# Altium project 3562.PrjPcb (part 5 of 5)

## Sheet P19_HDMI OUT.SchDoc
size 594 x 420 mm
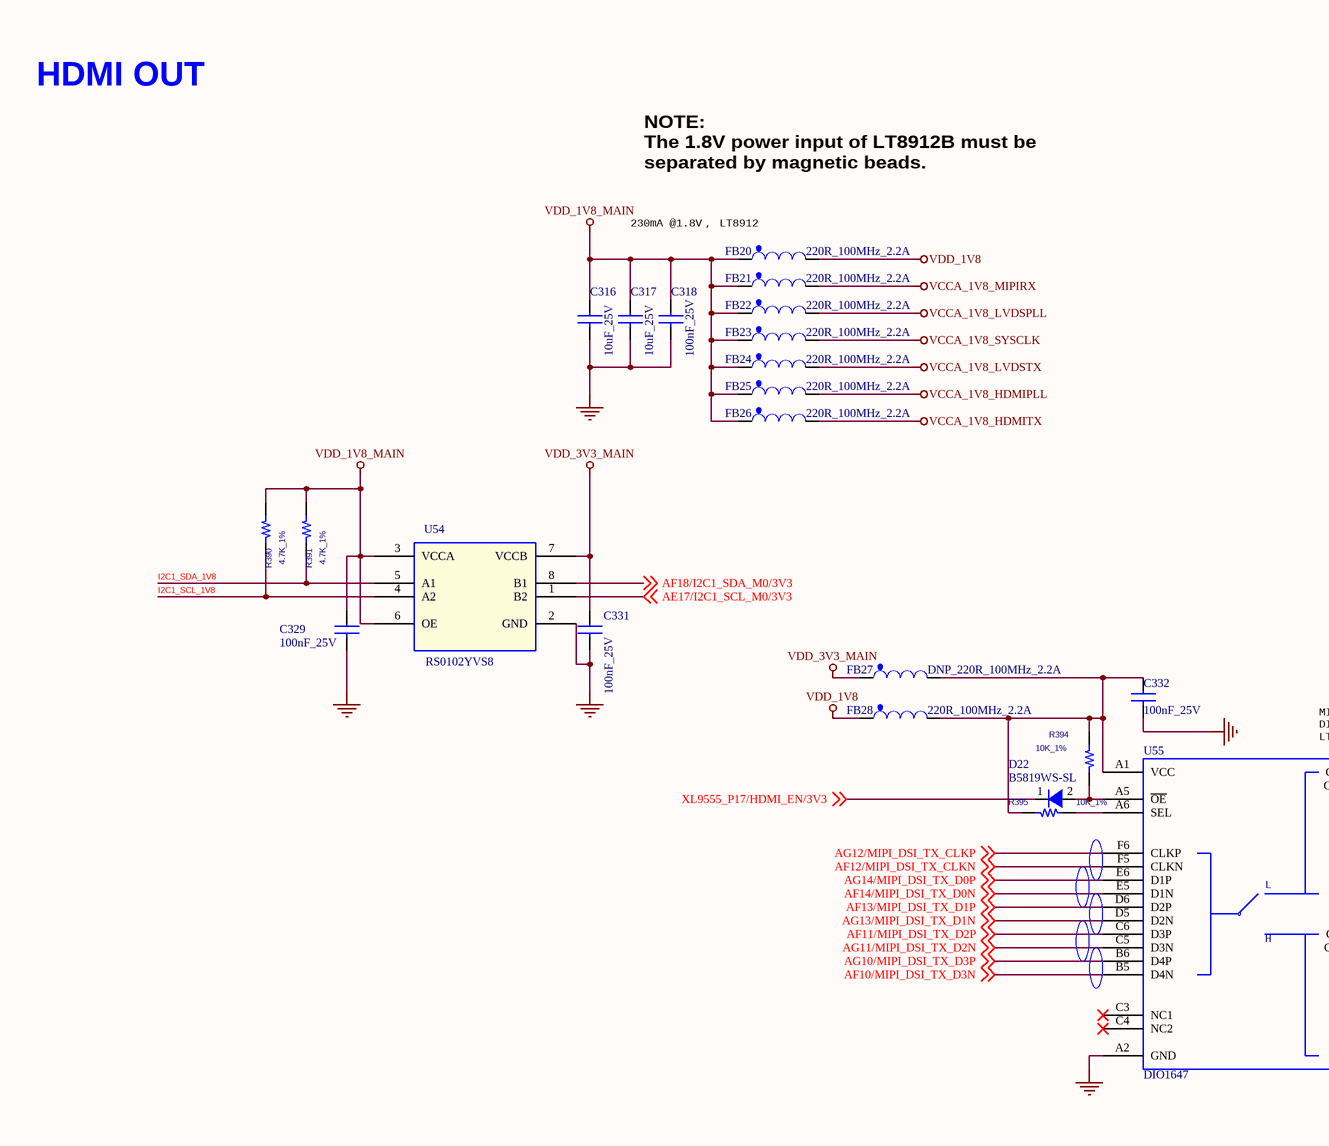
[diagram p36: P19_HDMI OUT.SchDoc, top left]
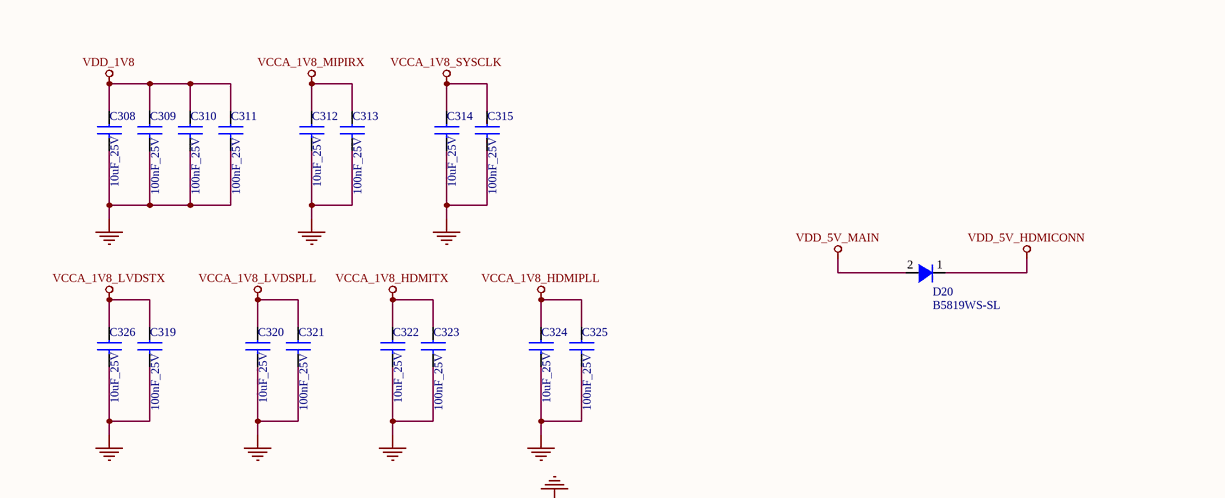
[diagram p37: P19_HDMI OUT.SchDoc, top right]
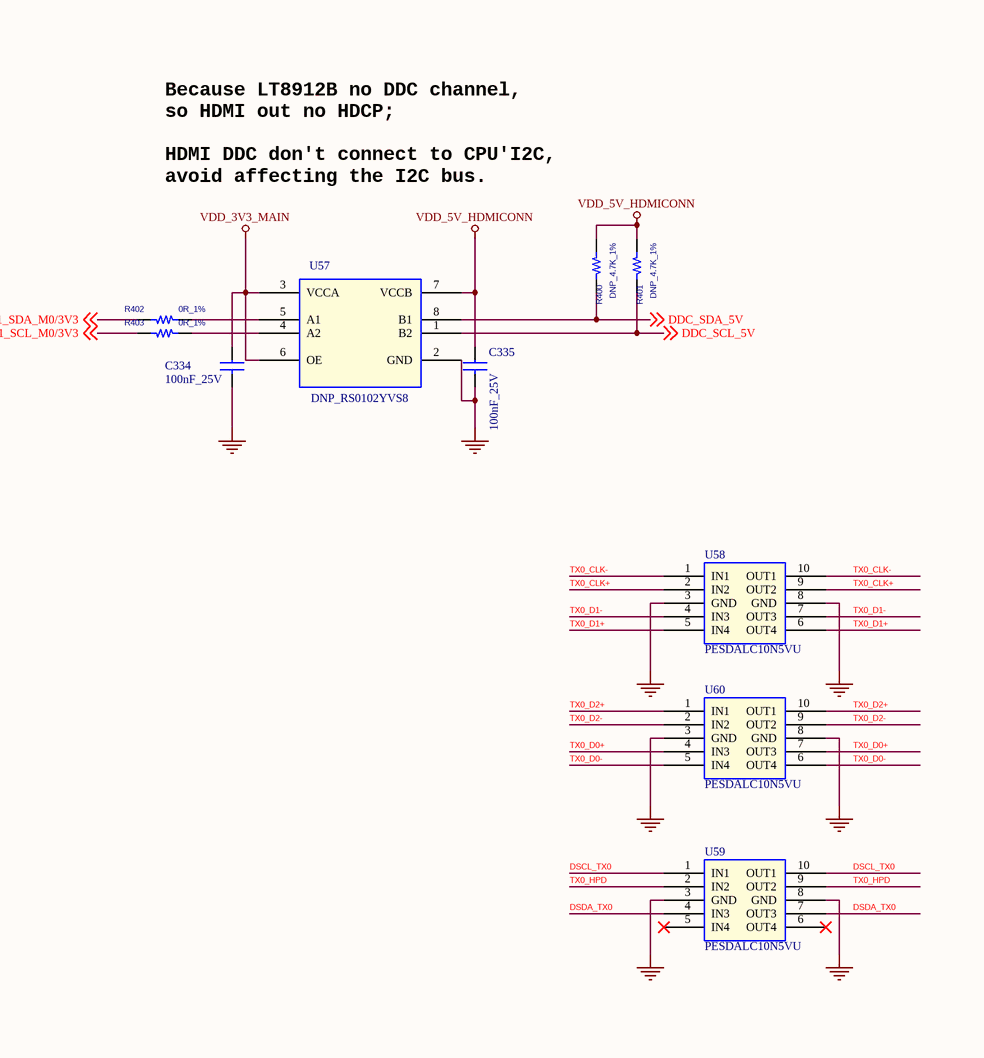
[diagram p38: P19_HDMI OUT.SchDoc, bottom left]
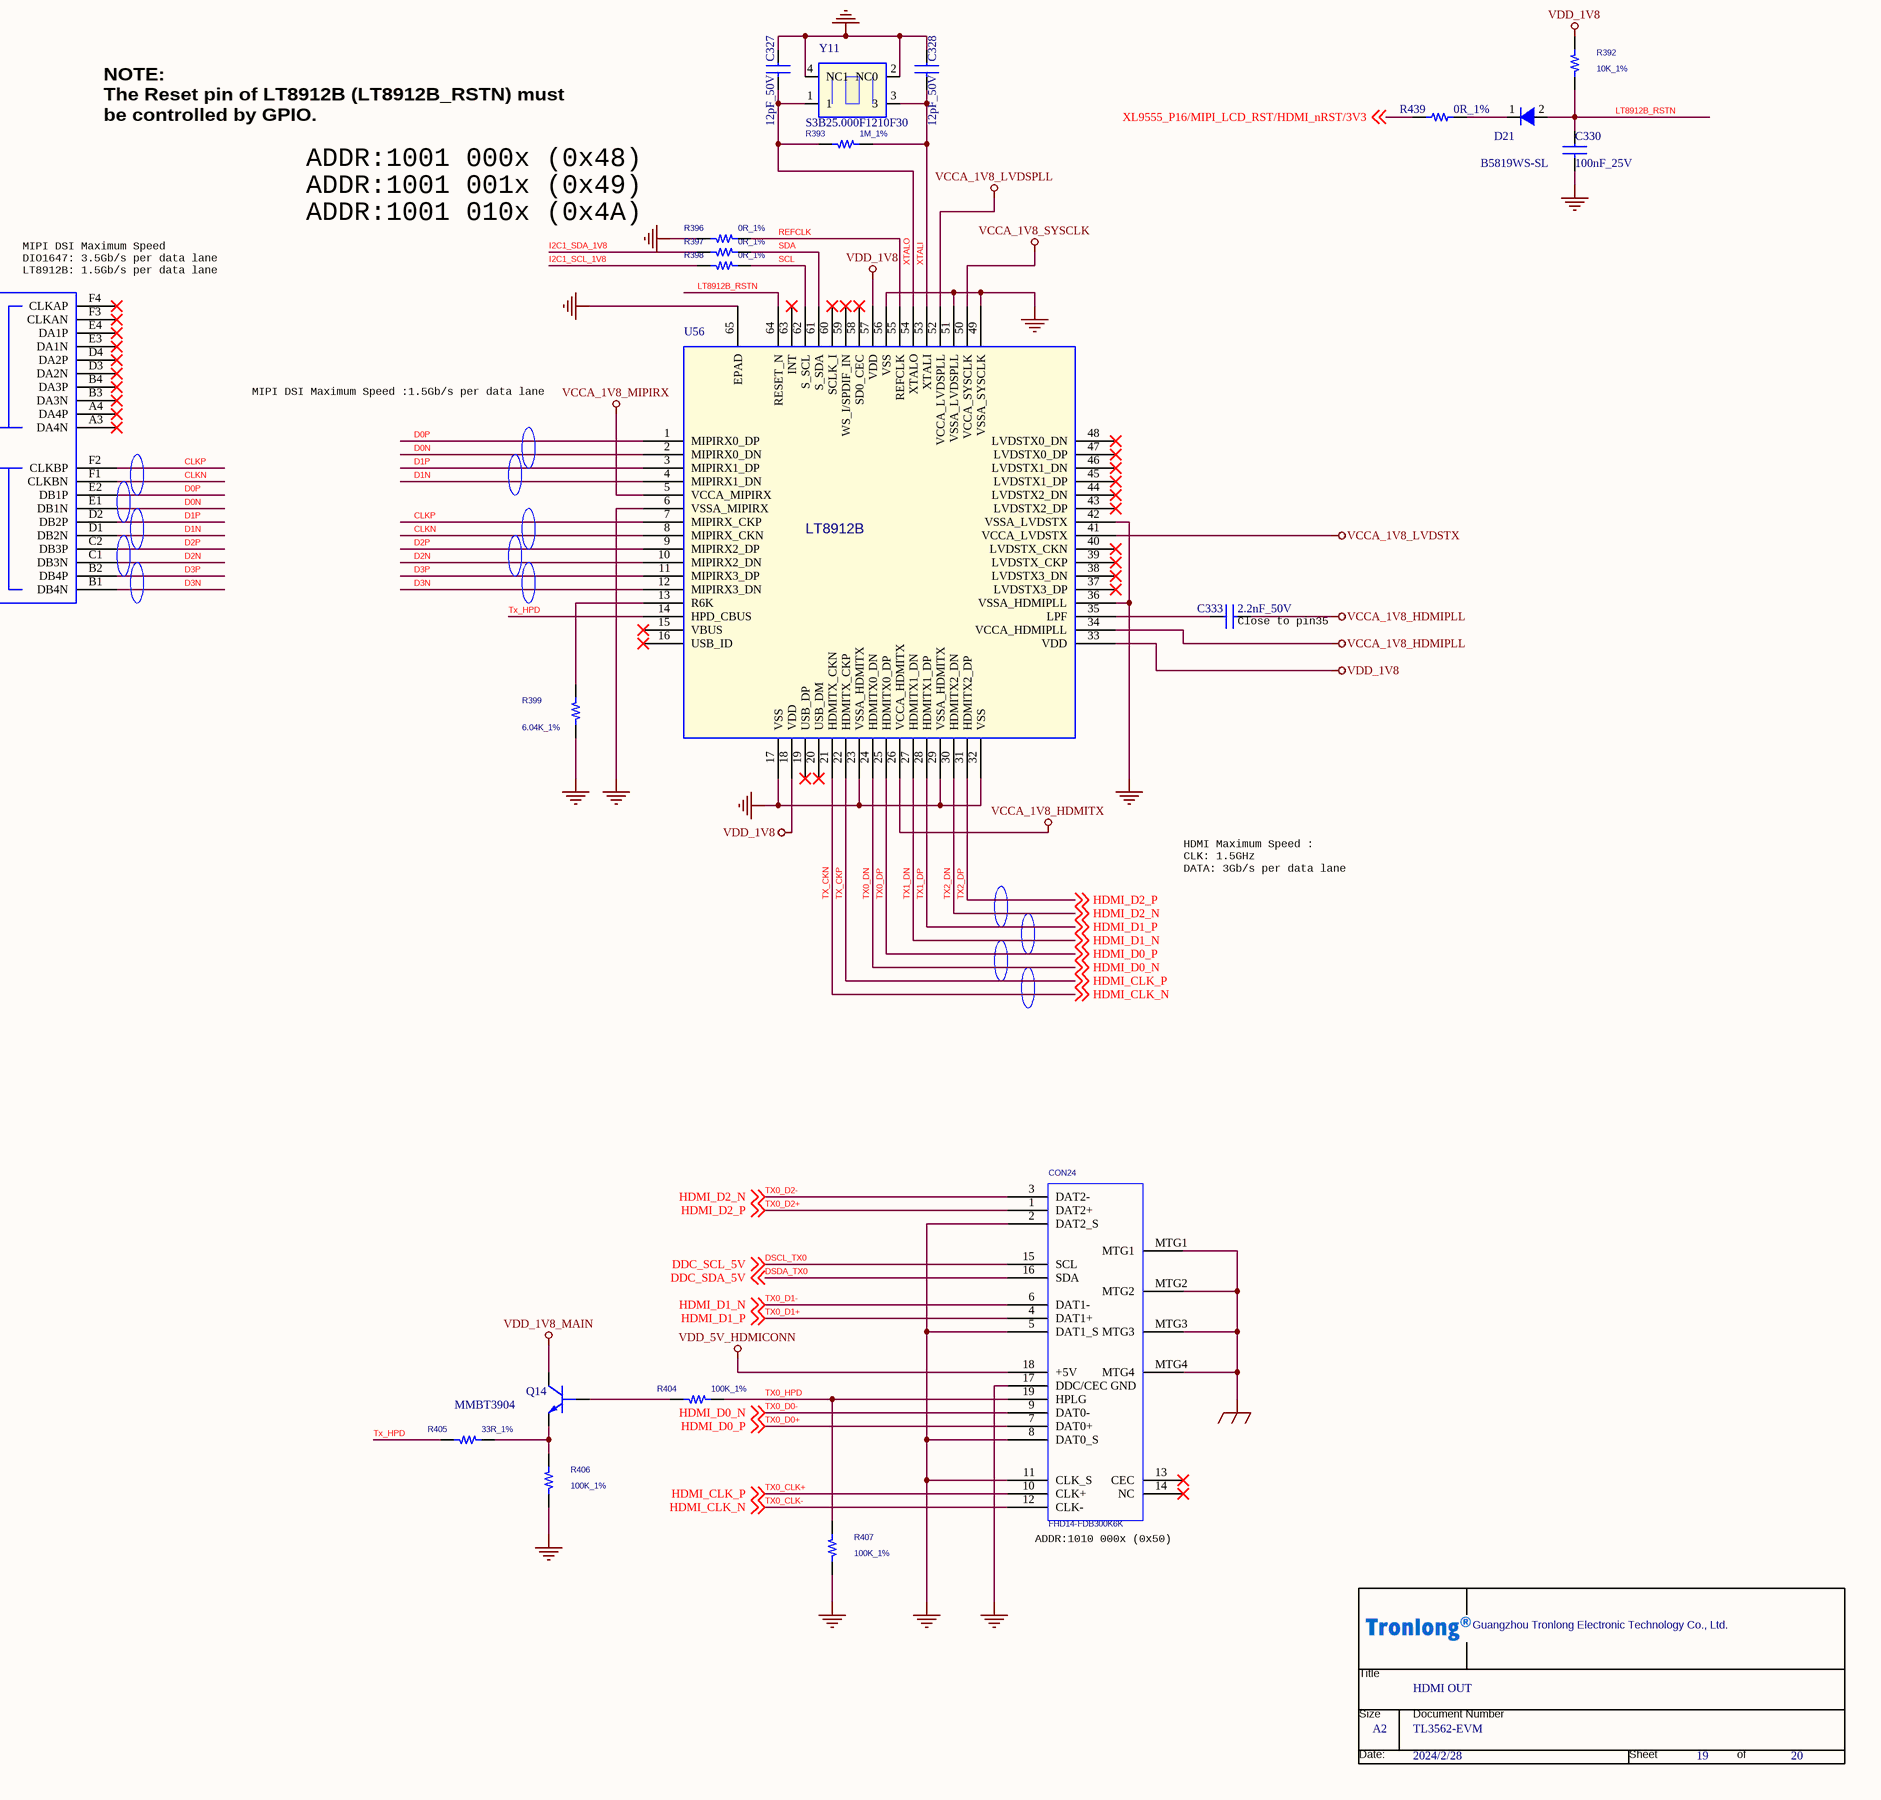
[diagram p39: P19_HDMI OUT.SchDoc, bottom right]

### Parts
(Parts that share a designator on the sheet are numbered #1, #2 ... from top to bottom, then left to right.)
*#19  Page Count: 20  Page Number: 19  Page Size: A2  OrgName: Guangzhou Tronlong Electronic Technology Co., Ltd.  Title: HDMI OUT  Doc: TL3562-EVM  Page Modify Date: 2024/2/28  (hidden comment: Tronlong_TITTLE_20211115)  (graphical)
C308  10uF_25V  [C0603]
C309  100nF_25V  [C0402]
C310  100nF_25V  [C0402]
C311  100nF_25V  [C0402]
C312  10uF_25V  [C0603]
C313  100nF_25V  [C0402]
C314  10uF_25V  [C0603]
C315  100nF_25V  [C0402]
C316  10uF_25V  [C0603]
C317  10uF_25V  [C0603]
C318  100nF_25V  [C0402]
C319  100nF_25V  [C0402]
C320  10uF_25V  [C0603]
C321  100nF_25V  [C0402]
C322  10uF_25V  [C0603]
C323  100nF_25V  [C0402]
C324  10uF_25V  [C0603]
C325  100nF_25V  [C0402]
C326  10uF_25V  [C0603]
C327  12pF_50V  [C0402]
C328  12pF_50V  [C0402]
C329  100nF_25V  [C0402]
C330  100nF_25V  [C0402]
C331  100nF_25V  [C0402]
C332  100nF_25V  [C0402]
C333  2.2nF_50V  [C0603]
C334  100nF_25V  [C0402]
C335  100nF_25V  [C0402]
CON24  FHD14-FDB300K6K  [DIP_HDMI-A]
D20  B5819WS-SL  [SOD-323]
D21  B5819WS-SL  [SOD-323]
D22  B5819WS-SL  [SOD-323]
FB20  220R_100MHz_2.2A  [L0603]
FB21  220R_100MHz_2.2A  [L0603]
FB22  220R_100MHz_2.2A  [L0603]
FB23  220R_100MHz_2.2A  [L0603]
FB24  220R_100MHz_2.2A  [L0603]
FB25  220R_100MHz_2.2A  [L0603]
FB26  220R_100MHz_2.2A  [L0603]
FB27  DNP_220R_100MHz_2.2A  [L0603]
FB28  220R_100MHz_2.2A  [L0603]
Q14  MMBT3904  [SOT23-3_DBZ3]
R390  4.7K_1%  [R0402]
R391  4.7K_1%  [R0402]
R392  10K_1%  [R0402]
R393  1M_1%  [R0603]
R394  10K_1%  [R0402]
R395  10K_1%  [R0402]
R396  0R_1%  [R0402]
R397  0R_1%  [R0402]
R398  0R_1%  [R0402]
R399  6.04K_1%  [R0402]
R400  DNP_4.7K_1%  [R0402]
R401  DNP_4.7K_1%  [R0402]
R402  0R_1%  [R0402]
R403  0R_1%  [R0402]
R404  100K_1%  [R0402]
R405  33R_1%  [R0402]
R406  100K_1%  [R0402]
R407  100K_1%  [R0402]
R439  0R_1%  [R0402]
U54  RS0102YVS8  [SOP8-20-91]
U55  DIO1647  [WLCSP-36-0d4mm]
U56  LT8912B  [QFN64_LT8912B]
U57  DNP_RS0102YVS8  [SOP8-20-91]
U58  PESDALC10N5VU  [DFN-10-2510]
U59  PESDALC10N5VU  [DFN-10-2510]
U60  PESDALC10N5VU  [DFN-10-2510]
Y11  S3B25.000F1210F30  [SMD_3225]

### Nets
EGND: CON24.MTG1 CON24.MTG2 CON24.MTG3 CON24.MTG4
GND: C308.2 C309.2 C310.2 C311.2 C312.2 C313.2 C314.2 C315.2 C316.2 C317.2 C318.2 C319.2 C320.2 C321.2 C322.2 C323.2 C324.2 C325.2 C326.2 C327.1 C328.1 C329.2 C330.2 C331.2 C332.2 C334.2 C335.2 CON24.2(DAT2_S) CON24.5(DAT1_S) CON24.8(DAT0_S) CON24.11(CLK_S) CON24.17(DDC/CEC_GND) R396.1 R399.1 R406.1 R407.1 U54.2(GND) U55.A2(GND) U56.6(VSSA_MIPIRX) U56.17(VSS) U56.23(VSSA_HDMITX) U56.29(VSSA_HDMITX) U56.32(VSS) U56.36(VSSA_HDMIPLL) U56.42(VSSA_LVDSTX) U56.49(VSSA_SYSCLK) U56.51(VSSA_LVDSPLL) U56.56(VSS) U56.65(EPAD) U57.2(GND) U58.3(GND) U58.8(GND) U59.3(GND) U59.8(GND) U60.3(GND) U60.8(GND) Y11.2(NC0) Y11.4(NC1)
VCCA_1V8_HDMIPLL: C324.1 C325.1 C333.2 FB25.2 U56.34(VCCA_HDMIPLL)
VCCA_1V8_HDMITX: C322.1 C323.1 FB26.2 U56.26(VCCA_HDMITX)
VCCA_1V8_LVDSPLL: C320.1 C321.1 FB22.2 U56.52(VCCA_LVDSPLL)
VCCA_1V8_LVDSTX: C319.1 C326.1 FB24.2 U56.41(VCCA_LVDSTX)
VCCA_1V8_MIPIRX: C312.1 C313.1 FB21.2 U56.5(VCCA_MIPIRX)
VCCA_1V8_SYSCLK: C314.1 C315.1 FB23.2 U56.50(VCCA_SYSCLK)
VDD_1V8: C308.1 C309.1 C310.1 C311.1 FB20.2 FB28.1 R392.2 U56.18(VDD) U56.33(VDD) U56.57(VDD)
VDD_1V8_MAIN: C316.1 C317.1 C318.1 C329.1 FB20.1 FB21.1 FB22.1 FB23.1 FB24.1 FB25.1 FB26.1 Q14.3(C) R390.2 R391.2 U54.3(VCCA) U54.6(OE)
VDD_3V3_MAIN: C331.1 C334.1 FB27.1 U54.7(VCCB) U57.3(VCCA) U57.6(OE)
VDD_5V_HDMICONN: C335.1 CON24.18(+5V) D20.1(Anode) R400.2 R401.2 U57.7(VCCB)
VDD_5V_MAIN: D20.2(Cathode)
AE17/I2C1_SCL_M0/3V3: R403.2 U54.1(B2) ; off-sheet AE17/I2C1_SCL_M0/3V3  [project net I2C1_SCL]
AF10/MIPI_DSI_TX_D3N: U55.B5(D4N) ; off-sheet AF10/MIPI_DSI_TX_D3N
AF11/MIPI_DSI_TX_D2P: U55.C6(D3P) ; off-sheet AF11/MIPI_DSI_TX_D2P
AF12/MIPI_DSI_TX_CLKN: U55.F5(CLKN) ; off-sheet AF12/MIPI_DSI_TX_CLKN
AF13/MIPI_DSI_TX_D1P: U55.D6(D2P) ; off-sheet AF13/MIPI_DSI_TX_D1P
AF14/MIPI_DSI_TX_D0N: U55.E5(D1N) ; off-sheet AF14/MIPI_DSI_TX_D0N
AF18/I2C1_SDA_M0/3V3: R402.2 U54.8(B1) ; off-sheet AF18/I2C1_SDA_M0/3V3  [project net I2C1_SDA]
AG10/MIPI_DSI_TX_D3P: U55.B6(D4P) ; off-sheet AG10/MIPI_DSI_TX_D3P
AG11/MIPI_DSI_TX_D2N: U55.C5(D3N) ; off-sheet AG11/MIPI_DSI_TX_D2N
AG12/MIPI_DSI_TX_CLKP: U55.F6(CLKP) ; off-sheet AG12/MIPI_DSI_TX_CLKP
AG13/MIPI_DSI_TX_D1N: U55.D5(D2N) ; off-sheet AG13/MIPI_DSI_TX_D1N
AG14/MIPI_DSI_TX_D0P: U55.E6(D1P) ; off-sheet AG14/MIPI_DSI_TX_D0P
CLKN: U55.F1(CLKBN) U56.8(MIPIRX_CKN)
CLKP: U55.F2(CLKBP) U56.7(MIPIRX_CKP)
D0N: U55.E1(DB1N) U56.2(MIPIRX0_DN)
D0P: U55.E2(DB1P) U56.1(MIPIRX0_DP)
D1N: U55.D1(DB2N) U56.4(MIPIRX1_DN)
D1P: U55.D2(DB2P) U56.3(MIPIRX1_DP)
D2N: U55.C1(DB3N) U56.10(MIPIRX2_DN)
D2P: U55.C2(DB3P) U56.9(MIPIRX2_DP)
D3N: U55.B1(DB4N) U56.12(MIPIRX3_DN)
D3P: U55.B2(DB4P) U56.11(MIPIRX3_DP)
DSCL_TX0: CON24.15(SCL) R401.1 U57.1(B2) U59.1(IN1) U59.10(OUT1) ; off-sheet DDC_SCL_5V  [also labelled DDC_SCL_5V]
DSDA_TX0: CON24.16(SDA) R400.1 U57.8(B1) U59.4(IN3) U59.7(OUT3) ; off-sheet DDC_SDA_5V  [also labelled DDC_SDA_5V]
I2C1_SCL_1V8: R390.1 R398.1 U54.4(A2)
I2C1_SDA_1V8: R391.1 R397.1 U54.5(A1)
LT8912B_RSTN: C330.1 D21.2(Cathode) R392.1 U56.64(RESET_N)
REFCLK: R396.2 U56.55(REFCLK)
SCL: R398.2 U56.62(S_SCL)
SDA: R397.2 U56.61(S_SDA)
TX0_CLK+: CON24.10(CLK+) U56.22(HDMITX_CKP) U58.2(IN2) U58.9(OUT2) ; off-sheet HDMI_CLK_P  [also labelled HDMI_CLK_P, TX_CKP]
TX0_CLK-: CON24.12(CLK-) U56.21(HDMITX_CKN) U58.1(IN1) U58.10(OUT1) ; off-sheet HDMI_CLK_N  [also labelled HDMI_CLK_N, TX_CKN]
TX0_D0+: CON24.7(DAT0+) U56.25(HDMITX0_DP) U60.4(IN3) U60.7(OUT3) ; off-sheet HDMI_D0_P  [also labelled HDMI_D0_P, TX0_DP]
TX0_D0-: CON24.9(DAT0-) U56.24(HDMITX0_DN) U60.5(IN4) U60.6(OUT4) ; off-sheet HDMI_D0_N  [also labelled HDMI_D0_N, TX0_DN]
TX0_D1+: CON24.4(DAT1+) U56.28(HDMITX1_DP) U58.5(IN4) U58.6(OUT4) ; off-sheet HDMI_D1_P  [also labelled HDMI_D1_P, TX1_DP]
TX0_D1-: CON24.6(DAT1-) U56.27(HDMITX1_DN) U58.4(IN3) U58.7(OUT3) ; off-sheet HDMI_D1_N  [also labelled HDMI_D1_N, TX1_DN]
TX0_D2+: CON24.1(DAT2+) U56.31(HDMITX2_DP) U60.1(IN1) U60.10(OUT1) ; off-sheet HDMI_D2_P  [also labelled HDMI_D2_P, TX2_DP]
TX0_D2-: CON24.3(DAT2-) U56.30(HDMITX2_DN) U60.2(IN2) U60.9(OUT2) ; off-sheet HDMI_D2_N  [also labelled HDMI_D2_N, TX2_DN]
TX0_HPD: CON24.19(HPLG) R404.1 R407.2 U59.2(IN2) U59.9(OUT2)
Tx_HPD: R405.2 U56.14(HPD_CBUS)
XL9555_P16/MIPI_LCD_RST/HDMI_nRST/3V3: R439.2 ; off-sheet XL9555_P16/MIPI_LCD_RST/HDMI_nRST/3V3
XL9555_P17/HDMI_EN/3V3: D22.1(Anode) ; off-sheet XL9555_P17/HDMI_EN/3V3
XTALI: C328.2 R393.1 U56.53(XTALI) Y11.3
XTALO: C327.2 R393.2 U56.54(XTALO) Y11.1
NetC332_1: C332.1 FB27.2 FB28.2 R394.1 R395.1 U55.A1(VCC)
NetC333_1: C333.1 U56.35(LPF)
NetD21_1: D21.1(Anode) R439.1
NetD22_2: D22.2(Cathode) R394.2 U55.A5(~{OE})
NetQ14_1: Q14.1(B) R404.2
NetQ14_2: Q14.2(E) R405.1 R406.2
NetR395_2: R395.2 U55.A6(SEL)
NetR399_2: R399.2 U56.13(R6K)
NetR402_1: R402.1 U57.5(A1)
NetR403_1: R403.1 U57.4(A2)

Not connected (* = marked no-connect by the designer): CON24 13(CEC)* 14(NC)*; U55 A3(DA4N)* A4(DA4P)* B3(DA3N)* B4(DA3P)* C3(NC1)* C4(NC2)* D3(DA2N)* D4(DA2P)* E3(DA1N)* E4(DA1P)* F3(CLKAN)* F4(CLKAP)*; U56 15(VBUS)* 16(USB_ID)* 19(USB_DP)* 20(USB_DM)* 37(LVDSTX3_DP)* 38(LVDSTX3_DN)* 39(LVDSTX_CKP)* 40(LVDSTX_CKN)* 43(LVDSTX2_DP)* 44(LVDSTX2_DN)* 45(LVDSTX1_DP)* 46(LVDSTX1_DN)* 47(LVDSTX0_DP)* 48(LVDSTX0_DN)* 58(SD0_CEC)* 59(WS_I/SPDIF_IN)* 60(SCLK_I)* 63(INT)*; U59 5(IN4)* 6(OUT4)*

### Notes on the sheet
- HDMI OUT
- NOTE:
  The 1.8V power input of LT8912B must be
  separated by magnetic beads.
- (near FB20) 230mA @1.8V， LT8912
- NOTE:
  The Reset pin of LT8912B (LT8912B_RSTN) must
  be controlled by GPIO.
- ADDR:1001 000x (0x48)
- ADDR:1001 010x (0x4A)
- ADDR:1001 001x (0x49)
- (near U55) MIPI DSI Maximum Speed
  DIO1647: 3.5Gb/s per data lane
  LT8912B: 1.5Gb/s per data lane
- MIPI DSI Maximum Speed :1.5Gb/s per data lane
- (near C333) Close to pin35
- Because LT8912B no DDC channel,
  so HDMI out no HDCP;
  HDMI DDC don't connect to CPU'I2C,
  avoid affecting the I2C bus.
- HDMI Maximum Speed :
  CLK: 1.5GHz
  DATA: 3Gb/s per data lane
- (near CON24) ADDR:1010 000x (0x50)
- (in symbol DIO1647_0) L; H
- (in symbol Tronlong_TITTLE_20211115) Title; Size; Document Number; Date:; Sheet; of

### Library data of the parts
*#19 = Tronlong_TITTLE_20211115: RevCode: A?; Page Create Date: March  8, 1995
C308 C312 C316 C320 C324 = CAP_NP0603: 贴片陶瓷电容,10uF,10%,10V,X5R; Manufacturer Character: 中国大陆; Designer: Hujin; PCB Footprint Status: Checked; Standard PCB Footprint: 0603; Purchase Information: 13510796878 伊美尔电子; As-Welded: /; Operation Temperature（℃）: -55~85℃; Create Date: 20130122; Part Number: 117-00-3043; Part Type: CAPACITOR; Price: 0.1; Part Status: On Hand; PCB Footprint: C0603
C309-C311 C313 C319 C321 C323 = CAP_NP0603: 贴片陶瓷电容,100nF,10%,25V,X5R; Manufacturer Character: 中国大陆; Designer: Hujin; Purchase Information: 13510796878 伊美尔电子; Standard PCB Footprint: 0603; PCB Footprint Status: Checked; As-Welded: /; Operation Temperature（℃）: -55~85℃; Create Date: 20130122; Part Status: On Hand; Price: 0.0072; Part Type: CAPACITOR; Part Number: 117-00-3036; PCB Footprint: C0402
C314 C317 C322 = CAP_NP0603: 贴片陶瓷电容,10uF,10%,10V,X5R; Manufacturer Character: 中国大陆; Designer: Hujin; Purchase Information: 13510796878 伊美尔电子; Standard PCB Footprint: 0603; PCB Footprint Status: Checked; As-Welded: /; Operation Temperature（℃）: -55~85℃; Create Date: 20130122; Part Status: On Hand; Price: 0.1; Part Type: CAPACITOR; Part Number: 117-00-3043; PCB Footprint: C0603
C315 = CAP_NP0603: 贴片陶瓷电容,100nF,10%,25V,X5R; Manufacturer Character: 中国大陆; Designer: Hujin; Operation Temperature（℃）: -55~85℃; Purchase Information: 13510796878 伊美尔电子; Standard PCB Footprint: 0603; PCB Footprint Status: Checked; As-Welded: /; Create Date: 20130122; Part Status: On Hand; Price: 0.0072; Part Type: CAPACITOR; Part Number: 117-00-3036; PCB Footprint: C0402
C318 C325 = CAP_NP0603: 贴片陶瓷电容,100nF,10%,25V,X5R; Manufacturer Character: 中国大陆; Designer: Hujin; PCB Footprint Status: Checked; Standard PCB Footprint: 0603; Purchase Information: 13510796878 伊美尔电子; As-Welded: /; Operation Temperature（℃）: -55~85℃; Create Date: 20130122; Part Number: 117-00-3036; Part Type: CAPACITOR; Price: 0.0072; Part Status: On Hand; PCB Footprint: C0402
C326 = CAP_NP0603: 贴片陶瓷电容,10uF,10%,10V,X5R; Manufacturer Character: 中国大陆; Designer: Hujin; Operation Temperature（℃）: -55~85℃; As-Welded: /; Purchase Information: 13510796878 伊美尔电子; Standard PCB Footprint: 0603; PCB Footprint Status: Checked; Create Date: 20130122; Part Status: On Hand; Price: 0.1; Part Type: CAPACITOR; Part Number: 117-00-3043; PCB Footprint: C0603
C327 = CAP_NP0603: 贴片陶瓷电容,12pF,5%,50V,COG; Manufacturer Character: 中国大陆; Designer: Hujin; As-Welded: /; Operation Temperature（℃）: -55~125℃; Purchase Information: 13510796878 伊美尔电子; Standard PCB Footprint: 0603; PCB Footprint Status: Checked; Create Date: 20130122; Part Status: On Hand; Price: 0.0072; Part Type: CAPACITOR; Part Number: 117-00-3002; PCB Footprint: C0402
C328 = CAP_NP0603: 贴片陶瓷电容,12pF,5%,50V,COG; Manufacturer Character: 中国大陆; Designer: Hujin; Purchase Information: 13510796878 伊美尔电子; Standard PCB Footprint: 0603; PCB Footprint Status: Checked; As-Welded: /; Operation Temperature（℃）: -55~125℃; Create Date: 20130122; Part Status: On Hand; Price: 0.0072; Part Type: CAPACITOR; Part Number: 117-00-3002; PCB Footprint: C0402
C329 C331 C334 C335 = CAP NP_Dup3: 贴片陶瓷电容,100nF,10%,25V,X5R; Manufacturer Character: 中国大陆; Operation Temperature（℃）: -55~85℃; As-Welded: /; PCB Footprint: C0402; Temperature: -55~125℃
C330 = CAP_NP0603: 贴片陶瓷电容,100nF,10%,25V,X5R; Manufacturer Character: 中国大陆; Designer: Hujin; Operation Temperature（℃）: -55~85℃; As-Welded: /; Purchase Information: 13510796878 伊美尔电子; Standard PCB Footprint: 0603; PCB Footprint Status: Checked; Create Date: 20130122; Part Status: On Hand; Price: 0.0072; Part Type: CAPACITOR; Part Number: 117-00-3036; PCB Footprint: C0402
C332 = CAP_NP: 贴片陶瓷电容,100nF,10%,25V,X5R; Manufacturer Character: 中国大陆; Operation Temperature（℃）: -55~85℃; As-Welded: /; Purchase Information: 13510796878 伊美尔电子; Standard PCB Footprint: 0603; PCB Footprint Status: Checked; Temperature: -55~125℃; Part Status: On Hand; Price: 0.0072; Part Type: CAPACITOR; Part Number: 117-00-3036; PCB Footprint: C0402
C333 = CAP_NP0603: 2.2nF,10%,C0603,50V,; Manufacturer Character: 中国大陆; Designer: Hujin; As-Welded: /; Operation Temperature（℃）: -40~85℃; Purchase Information: 13510796878 伊美尔电子; Standard PCB Footprint: 0603; PCB Footprint Status: Checked; Create Date: 20130122; Part Status: On Hand; Price: 0.0072; Part Type: CAPACITOR; Part Number: 117-00-3023; PCB Footprint: C0603
CON24 = 2C_Conn_HDMI_TypeA: HDMI接口，19PIN，侧立，90度; PartName: Conn_HDMI_A; Mfr: FCI; MfrNum: 10029449-001RLF; TIIntPartnumber: 2C0085; Manufacturer Character: 中国大陆; Manufacturer: 深圳特思嘉工业电子有限公司（TXGA）; DescriptiveText: Connector HDMI Type A RA; Vendor: Digikey; Cost100: 0.91; Cost10K: 0.37; PCB Footprint: SMD_Ratbd; Operation Temperature（℃）: -40~85℃; Temperature: -25~75℃; Remark: HDMI接口，19PIN，侧立，90度; Manufacturer PartNumber: FHD14-FDB300K6K
D20 D22 = Diode200mA250V_2: 肖特基二极管,VR=40V,IF=1A,VF=0.6V@1A; TIIntPartnumber: 1E0013; MfrNum: MMSD103T1G; Mfr: On Semiconductor; Manufacturer Character: 中国大陆; Manufacturer: 江苏长晶科技有限公司（JSCJ）; DescriptiveText: Diode 200mA 250V 1.25V Forward Drop; PCB Footprint: smd123; Cost10K: 0.07; Cost100: 0.23; Vendor: Digikey; As-Welded: /; Operation Temperature（℃）: -55~125℃; PartName: Diode200mA250V; Descriptive_Text: Diode 200mA 250V 1.25V Forward Drop; Temperature: -40~125℃; Manufacturer PartNumber: B5819WS-SL
D21 = Diode200mA250V_2: 肖特基二极管,VR=40V,IF=1A,VF=0.6V@1A; TIIntPartnumber: 1E0013; MfrNum: MMSD103T1G; Mfr: On Semiconductor; Manufacturer: 江苏长晶科技有限公司（JSCJ）; Manufacturer Character: 中国大陆; DescriptiveText: Diode 200mA 250V 1.25V Forward Drop; PCB Footprint: smd123; Cost10K: 0.07; Cost100: 0.23; Vendor: Digikey; As-Welded: /; Operation Temperature（℃）: -55~125℃; PartName: Diode200mA250V; Descriptive_Text: Diode 200mA 250V 1.25V Forward Drop; Temperature: -40~125℃; Manufacturer PartNumber: B5819WS-SL
FB20-FB26 = FERRITE BEAD: 磁珠,50mΩ,2.2A,220R@100MHz; Manufacturer Character: 中国大陆; Manufacturer: 深圳顺络电子股份有限公司（Sunlord）; Manufacturer PartNumber: UPZ1608U221-2R2TF; Purchase Information: 07558255526 小商行电子; Standard PCB Footprint: 0603; PCB Footprint Status: Checked; As-Welded: /; Operation Temperature（℃）: -55~125℃; Part Status: On Hand; Price: 0.011; Part Type: BEAD; Part Number: 647-01-3069; Temperature: -55~125℃; PCB Footprint: L0603
FB27 = FERRITE BEAD: 磁珠,50mΩ,2.2A,220R@100MHz; Manufacturer Character: 中国大陆; Manufacturer PartNumber: UPZ1608U221-2R2TF; Manufacturer: 深圳顺络电子股份有限公司（Sunlord）; Operation Temperature（℃）: -55~125℃; As-Welded: DNP; PCB Footprint Status: Checked; Standard PCB Footprint: 0603; Purchase Information: 07558255526 小商行电子; Temperature: -55~125℃; Part Number: 647-01-3069; Part Type: BEAD; Price: 0.011; Part Status: On Hand; PCB Footprint: L0603
FB28 = FERRITE BEAD: 磁珠,50mΩ,2.2A,220R@100MHz; Manufacturer Character: 中国大陆; Manufacturer PartNumber: UPZ1608U221-2R2TF; Manufacturer: 深圳顺络电子股份有限公司（Sunlord）; PCB Footprint Status: Checked; Standard PCB Footprint: 0603; Purchase Information: 07558255526 小商行电子; As-Welded: /; Operation Temperature（℃）: -55~125℃; Temperature: -55~125℃; Part Number: 647-01-3069; Part Type: BEAD; Price: 0.011; Part Status: On Hand; PCB Footprint: L0603
Q14 = MMBT3904/SOT: BJT,NPN,Vceo=40V,Ic=200mA,fT=300MHz,PD=200mW; Manufacturer Character: 中国大陆; Manufacturer: 江苏长晶科技有限公司（JSCJ）; As-Welded: /; Operation Temperature（℃）: -55~150℃; Manufacturer PartNumber: MMBT3904; Temperature: -55~150℃; PCB Footprint: SOT23-3_DBZ3
R390 = Resistor_Dup3: 贴片电阻,4.7K,±1%,1/16W; Manufacturer Character: 中国大陆; CLASS: DISCRETE; Operation Temperature（℃）: -55~155℃; As-Welded: /; PCB Footprint: R0402
R391 = Resistor_Dup3: 贴片电阻,4.7K,±1%,1/16W; Manufacturer Character: 中国大陆; CLASS: DISCRETE; As-Welded: /; Operation Temperature（℃）: -55~155℃; PCB Footprint: R0402
R392 = Resistor_Dup3: 贴片电阻,10K,±1%,1/16W; Manufacturer Character: 中国大陆; CLASS: DISCRETE; Operation Temperature（℃）: -55~155℃; As-Welded: /; PCB Footprint: R0402
R393 = Resistor_Dup3: 贴片电阻,1M,±1%,1/10W; Manufacturer Character: 中国大陆; CLASS: DISCRETE; Operation Temperature（℃）: -55~155℃; As-Welded: /; PCB Footprint: R0603
R394 R395 = 10_R_0: 贴片电阻,10K,±1%,1/16W; Manufacturer Character: 中国大陆; Part Field 1: 0; CLASS: DISCRETE; As-Welded: /; Operation Temperature（℃）: -55~155℃; Part Field 2: 0; Temperature: -55~155℃; PCB Footprint: R0402
R396-R398 R402 R403 R439 = Resistor_Dup3: 0R,±1%,R0402,≥1/16W; Manufacturer Character: 中国大陆; CLASS: DISCRETE; Operation Temperature（℃）: -55~155℃; As-Welded: /; PCB Footprint: R0402
R399 = Resistor_Dup3: 贴片电阻,6.04K,±1%,1/16W; Manufacturer Character: 中国大陆; CLASS: DISCRETE; Operation Temperature（℃）: -55~155℃; As-Welded: /; PCB Footprint: R0402
R400 R401 = Resistor_Dup3: 贴片电阻,4.7K,±1%,1/16W; Manufacturer Character: 中国大陆; CLASS: DISCRETE; As-Welded: DNP; Operation Temperature（℃）: -55~155℃; PCB Footprint: R0402
R404 R406 R407 = Resistor_Dup3: 贴片电阻,100K,±1%,1/16W; Manufacturer Character: 中国大陆; CLASS: DISCRETE; Operation Temperature（℃）: -55~155℃; As-Welded: /; PCB Footprint: R0402
R405 = Resistor_Dup3: 贴片电阻,33R,±1%,1/16W; Manufacturer Character: 中国大陆; CLASS: DISCRETE; Operation Temperature（℃）: -55~155℃; As-Welded: /; PCB Footprint: R0402
U54 = TXS0102DCUR: 2位双向电平转换器; Manufacturer Character: 中国大陆; Manufacturer: 江苏润石科技有限公司（RUNIC）; As-Welded: /; Operation Temperature（℃）: -40~85℃; Manufacturer PartNumber: RS0102YVS8; Temperature: -40~85℃; PCB Footprint: SOP8-20-91
U55 = DIO1647_0: 3.5GHz, 十单刀双掷MIPI 开关; Manufacturer Character: 中国大陆; Manufacturer PartNumber: DIO1647WL36; Manufacturer: 江苏帝奥微电子股份有限公司; As-Welded: /; Temperature: -40~85℃; PCB Footprint: WLCSP-36-0d4mm
U56 = LT8912B_QFN64_0: MIPI转HDMI/LVDS; Manufacturer Character: 中国大陆; Manufacturer: 龙迅半导体（合肥）股份有限公司; Part Description: LT8912B,QFN64; Standard PCB Footprint: QFN64; Operation Temperature（℃）: -40~85℃; As-Welded: /; Part Number: 566-00-3037; Part Type: LontiumIC; Part Status: On Hand; Manufacturer PartNumber: LT8912B; Temperature: -40~85℃; PCB Footprint: QFN64_LT8912B
U57 = TXS0102DCUR: 2位双向电平转换器; Manufacturer: 江苏润石科技有限公司（RUNIC）; Manufacturer Character: 中国大陆; Operation Temperature（℃）: -40~85℃; As-Welded: DNP; Temperature: -40~85℃; Manufacturer PartNumber: RS0102YVS8; PCB Footprint: SOP8-20-91
U58 U60 = RCLAMP0524P: 4通道超低电容瞬态抑制器; Manufacturer: 上海芯导电子科技有限公司（Prisemi）; Manufacturer Character: 中国大陆; As-Welded: /; Operation Temperature（℃）: -40~85℃; PCB Footprint: DFN-10-2510; Temperature: -55~125℃; Manufacturer PartNumber: PESDALC10N5VU
U59 = RCLAMP0524P: 4通道超低电容瞬态抑制器; Manufacturer Character: 中国大陆; Manufacturer: 上海芯导电子科技有限公司（Prisemi）; As-Welded: /; Operation Temperature（℃）: -40~85℃; PCB Footprint: DFN-10-2510; Temperature: -55~125℃; Manufacturer PartNumber: PESDALC10N5VU
Y11 = CRYS-4PIN: 四脚无源晶振,25MHz,±10ppm,12pF,30Ω,±30ppm; Manufacturer Character: 中国大陆; Manufacturer: 深圳市星通时频电子有限公司公司（JSCJ）; As-Welded: /; Operation Temperature（℃）: -40~85℃; Temperature: -40~85℃; Manufacturer PartNumber: S3B25.000F1210F30; PCB Footprint: SMD_3225

## Sheet P20_WIFI&BT_SDIO_IO EXPANDERS.SchDoc
size 420 x 297 mm
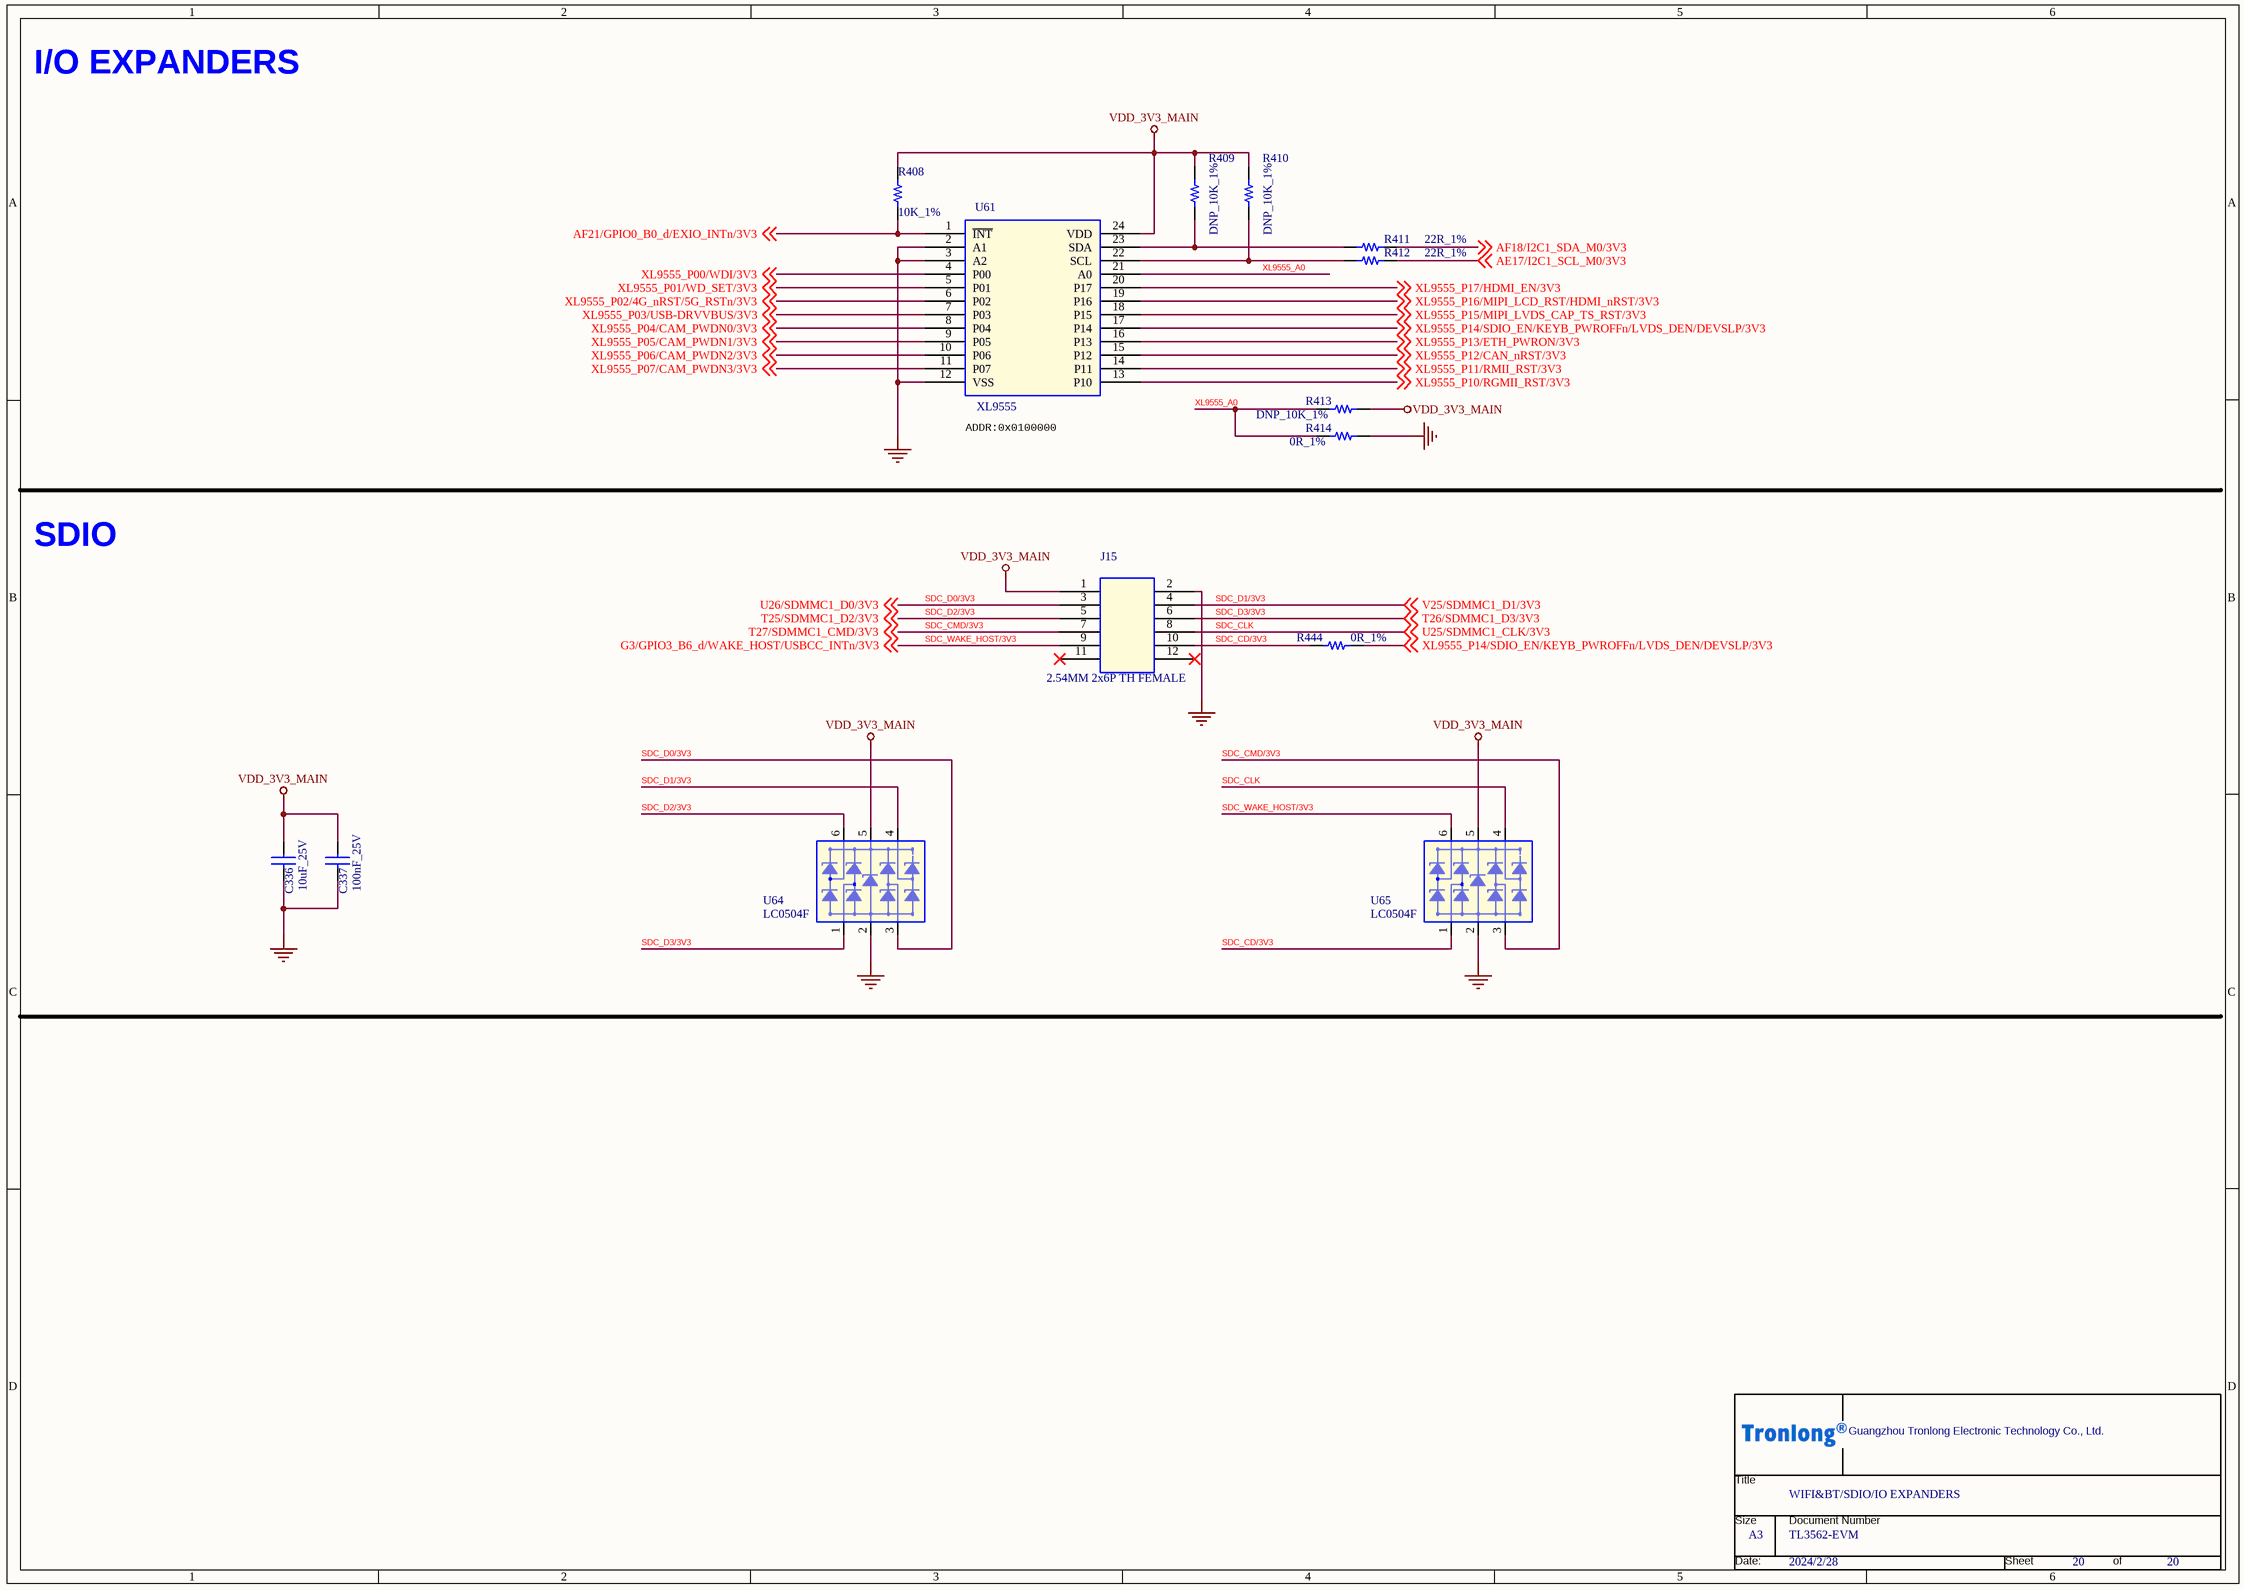
[diagram p40: P20_WIFI&BT_SDIO_IO EXPANDERS.SchDoc]

### Parts
(Parts that share a designator on the sheet are numbered #1, #2 ... from top to bottom, then left to right.)
*#20  Page Count: 20  Page Size: A3  OrgName: Guangzhou Tronlong Electronic Technology Co., Ltd.  Title: WIFI&BT/SDIO/IO EXPANDERS  Doc: TL3562-EVM  Page Modify Date: 2024/2/28  (hidden comment: Tronlong_TITTLE_20211115)  (graphical)
C336  10uF_25V  [C0603]
C337  100nF_25V  [C0402]
J15  2.54MM 2x6P TH FEMALE  [header_2x6_2d54_male]
R408  10K_1%  [R0402]
R409  DNP_10K_1%  [R0402]
R410  DNP_10K_1%  [R0402]
R411  22R_1%  [R0402]
R412  22R_1%  [R0402]
R413  DNP_10K_1%  [R0402]
R414  0R_1%  [R0603]
R444  0R_1%  [R0402]
U61  XL9555  [TSSOP24]
U64  LC0504F  [SOT363]
U65  LC0504F  [SOT363]

### Nets
GND: C336.2 C337.2 J15.2 R414.2 U61.2(A1) U61.3(A2) U61.12(VSS) U64.2 U65.2
VDD_3V3_MAIN: C336.1 C337.1 J15.1 R408.1 R409.1 R410.1 R413.1 U61.24(VDD) U64.5 U65.5
AE17/I2C1_SCL_M0/3V3: R412.1 ; off-sheet AE17/I2C1_SCL_M0/3V3  [project net I2C1_SCL]
AF18/I2C1_SDA_M0/3V3: R411.1 ; off-sheet AF18/I2C1_SDA_M0/3V3  [project net I2C1_SDA]
AF21/GPIO0_B0_d/EXIO_INTn/3V3: R408.2 U61.1(~{INT}) ; off-sheet AF21/GPIO0_B0_d/EXIO_INTn/3V3
SDC_CD/3V3: J15.10 R444.2 U65.1
SDC_CLK: J15.8 U65.4 ; off-sheet U25/SDMMC1_CLK/3V3  [also labelled U25/SDMMC1_CLK/3V3]
SDC_CMD/3V3: J15.7 U65.3 ; off-sheet T27/SDMMC1_CMD/3V3  [also labelled T27/SDMMC1_CMD/3V3]
SDC_D0/3V3: J15.3 U64.3 ; off-sheet U26/SDMMC1_D0/3V3  [also labelled U26/SDMMC1_D0/3V3]
SDC_D1/3V3: J15.4 U64.4 ; off-sheet V25/SDMMC1_D1/3V3  [also labelled V25/SDMMC1_D1/3V3]
SDC_D2/3V3: J15.5 U64.6 ; off-sheet T25/SDMMC1_D2/3V3  [also labelled T25/SDMMC1_D2/3V3]
SDC_D3/3V3: J15.6 U64.1 ; off-sheet T26/SDMMC1_D3/3V3  [also labelled T26/SDMMC1_D3/3V3]
SDC_WAKE_HOST/3V3: J15.9 U65.6 ; off-sheet G3/GPIO3_B6_d/WAKE_HOST/USBCC_INTn/3V3  [also labelled G3/GPIO3_B6_d/WAKE_HOST/USBCC_INTn/3V3]
XL9555_A0: R413.2 R414.1 U61.21(A0)
XL9555_P00/WDI/3V3: U61.4(P00) ; off-sheet XL9555_P00/WDI/3V3
XL9555_P01/WD_SET/3V3: U61.5(P01) ; off-sheet XL9555_P01/WD_SET/3V3
XL9555_P02/4G_nRST/5G_RSTn/3V3: U61.6(P02) ; off-sheet XL9555_P02/4G_nRST/5G_RSTn/3V3
XL9555_P03/USB-DRVVBUS/3V3: U61.7(P03) ; off-sheet XL9555_P03/USB-DRVVBUS/3V3
XL9555_P04/CAM_PWDN0/3V3: U61.8(P04) ; off-sheet XL9555_P04/CAM_PWDN0/3V3
XL9555_P05/CAM_PWDN1/3V3: U61.9(P05) ; off-sheet XL9555_P05/CAM_PWDN1/3V3
XL9555_P06/CAM_PWDN2/3V3: U61.10(P06) ; off-sheet XL9555_P06/CAM_PWDN2/3V3
XL9555_P07/CAM_PWDN3/3V3: U61.11(P07) ; off-sheet XL9555_P07/CAM_PWDN3/3V3
XL9555_P10/RGMII_RST/3V3: U61.13(P10) ; off-sheet XL9555_P10/RGMII_RST/3V3
XL9555_P11/RMII_RST/3V3: U61.14(P11) ; off-sheet XL9555_P11/RMII_RST/3V3
XL9555_P12/CAN_nRST/3V3: U61.15(P12) ; off-sheet XL9555_P12/CAN_nRST/3V3
XL9555_P13/ETH_PWRON/3V3: U61.16(P13) ; off-sheet XL9555_P13/ETH_PWRON/3V3
XL9555_P14/SDIO_EN/KEYB_PWROFFn/LVDS_DEN/DEVSLP/3V3: R444.1 U61.17(P14) ; off-sheet XL9555_P14/SDIO_EN/KEYB_PWROFFn/LVDS_DEN/DEVSLP/3V3
XL9555_P15/MIPI_LVDS_CAP_TS_RST/3V3: U61.18(P15) ; off-sheet XL9555_P15/MIPI_LVDS_CAP_TS_RST/3V3
XL9555_P16/MIPI_LCD_RST/HDMI_nRST/3V3: U61.19(P16) ; off-sheet XL9555_P16/MIPI_LCD_RST/HDMI_nRST/3V3
XL9555_P17/HDMI_EN/3V3: U61.20(P17) ; off-sheet XL9555_P17/HDMI_EN/3V3
NetR409_2: R409.2 R411.2 U61.23(SDA)
NetR410_2: R410.2 R412.2 U61.22(SCL)

Not connected (* = marked no-connect by the designer): J15 11* 12*

### Notes on the sheet
- I/O EXPANDERS
- (near U61) ADDR:0x0100000
- SDIO
- (in symbol Tronlong_TITTLE_20211115) Title; Size; Document Number; Date:; Sheet; of

### Library data of the parts
*#20 = Tronlong_TITTLE_20211115: RevCode: A?; Page Number: 20; Page Create Date: March  8, 1995
C336 = CAP NP_Dup3: 贴片陶瓷电容,10uF,10%,10V,X5R; Manufacturer Character: 中国大陆; As-Welded: /; Operation Temperature（℃）: -55~85℃; PCB Footprint: C0603
C337 = CAP NP_Dup3: as C329 on sheet P19_HDMI OUT; PCB Footprint: C0402
J15 = CON12A: 排母,2X6PIN,间距2.54MM,180度,插件; Manufacturer: 深圳市长江连接器有限公司（CJT）; Manufacturer PartNumber: A2541HWV-2x6P; Manufacturer Character: 中国大陆; As-Welded: /; Temperature: -55~105℃; PCB Footprint: header_2x6_2d54_male
R408 = Resistor_Dup1: 贴片电阻,10K,±1%,1/16W; Manufacturer Character: 中国大陆; CLASS: DISCRETE; As-Welded: /; Operation Temperature（℃）: -55~155℃; PCB Footprint: R0402; Temperature: -55~155℃
R409 R410 R413 = Resistor_Dup1: 贴片电阻,10K,±1%,1/16W; Manufacturer Character: 中国大陆; CLASS: DISCRETE; Operation Temperature（℃）: -55~155℃; As-Welded: DNP; Temperature: -55~155℃; PCB Footprint: R0402
R411 = Resistor_Dup1: 贴片电阻,22R,±1%,1/16W; Manufacturer Character: 中国大陆; CLASS: DISCRETE; As-Welded: /; Operation Temperature（℃）: -55~155℃; Temperature: -55~155℃; PCB Footprint: R0402
R412 = Resistor_Dup1: 贴片电阻,22R,±1%,1/16W; Manufacturer Character: 中国大陆; CLASS: DISCRETE; Operation Temperature（℃）: -55~155℃; As-Welded: /; Temperature: -55~155℃; PCB Footprint: R0402
R414 = Resistor_Dup1: 贴片电阻,0R,±1%,1/10W; Manufacturer Character: 中国大陆; CLASS: DISCRETE; As-Welded: /; Operation Temperature（℃）: -55~155℃; PCB Footprint: R0603; Temperature: -55~155℃
R444 = Resistor_Dup3: 贴片电阻,0R,±1%,1/16W; Manufacturer Character: 中国大陆; CLASS: DISCRETE; Operation Temperature（℃）: -55~155℃; As-Welded: /; PCB Footprint: R0402
U61 = XL9555_0: 拓展IO芯片; Manufacturer: 信路达信息技术（厦门）有限公司（xinluda）; Manufacturer Character: 中国大陆; Operation Temperature（℃）: -40~85℃; As-Welded: /; PCB Footprint: TSSOP24; Manufacturer PartNumber: XL9555; Temperature: -40~85℃
U64 U65 = PRTR5V0U4Y_0: ESD二极管,VRWM=5V,VBR=6V,四组,单向,8KV,15KV; Manufacturer: 上海雷卯电子科技有限公司（Leiditech）; Manufacturer Character: 中国大陆; Operation Temperature（℃）: -55~125℃; room: SD; As-Welded: /; Manufacturer Part Number: PRTR5V0U4Y; Manufacturer PartNumber: LC0504F; Temperature: -40~85℃; PCB Footprint: SOT363

## Nets that join several sheets
EGND: P04_POWER (7 pins), P06_DEBUG UART_RTC_WD (CON5.1 CON5.2 CON5.3 CON5.4), P08_RS485_RS232_CAN (CON9.10 CON9.11), P09_USB HOST_USB OTG (8 pins), P10_ETH0 RGMII (CON12.10 CON12.17 CON12.18 FB12.2), P11_ETH1 RMII (CON13.7 CON13.8 CON13.15 CON13.16), P19_HDMI OUT (CON24.MTG1 CON24.MTG2 CON24.MTG3 CON24.MTG4)
GND: P03_SOM CONNECTOR (33 pins), P04_POWER (67 pins), P05_BOOT SET_KEY_LED_SPI_ADC (27 pins), P06_DEBUG UART_RTC_WD (30 pins), P07_MICRO SD_FAN_ARM JTAG (33 pins), P08_RS485_RS232_CAN (39 pins), P09_USB HOST_USB OTG (57 pins), P10_ETH0 RGMII (45 pins), P11_ETH1 RMII (31 pins), P15_4G_5G_NVME (55 pins), P19_HDMI OUT (58 pins), P20_WIFI&BT_SDIO_IO EXPANDERS (9 pins)
VDD_1V8_MAIN: P04_POWER (7 pins), P05_BOOT SET_KEY_LED_SPI_ADC (R419.2), P09_USB HOST_USB OTG (R167.1), P19_HDMI OUT (16 pins)
VDD_3V3_ACODEC: P03_SOM CONNECTOR (CON0.180), P08_RS485_RS232_CAN (C107.2 C108.2 U29.16), P15_4G_5G_NVME (R299.1 R300.1 R301.1)
VDD_3V3_MAIN: P03_SOM CONNECTOR (R4.2 R5.2 R6.2 R7.2), P04_POWER (9 pins), P05_BOOT SET_KEY_LED_SPI_ADC (6 pins), P06_DEBUG UART_RTC_WD (D8.1 FB5.2 R73.1 R74.1), P07_MICRO SD_FAN_ARM JTAG (D25.2), P08_RS485_RS232_CAN (20 pins), P09_USB HOST_USB OTG (19 pins), P10_ETH0 RGMII (R195.1), P11_ETH1 RMII (FB13.1 FB14.1), P15_4G_5G_NVME (C243.2 R279.1 R288.1), P19_HDMI OUT (6 pins), P20_WIFI&BT_SDIO_IO EXPANDERS (10 pins)
VDD_3V3_SOM: P03_SOM CONNECTOR (7 pins), P04_POWER (6 pins)
VDD_3V3_SOM_OUT: P03_SOM CONNECTOR (CON0.120), P04_POWER (R30.2 R35.2 R37.1 R43.2), P06_DEBUG UART_RTC_WD (8 pins), P07_MICRO SD_FAN_ARM JTAG (12 pins), P15_4G_5G_NVME (R313.2)
VDD_5V_MAIN: P04_POWER (10 pins), P06_DEBUG UART_RTC_WD (FB4.2), P08_RS485_RS232_CAN (C95.1 C96.1 MK1.2), P09_USB HOST_USB OTG (6 pins), P19_HDMI OUT (D20.2)
VDD_12V_MAIN: P04_POWER (23 pins), P07_MICRO SD_FAN_ARM JTAG (FB6.1), P15_4G_5G_NVME (C264.1 C265.1 C266.1 U49.5)
1J14/RMII_MDC/3V3: P03_SOM CONNECTOR (R421.2), P11_ETH1 RMII (U40.22)
1J15/RMII_RXER/3V3: P03_SOM CONNECTOR (CON0.100), P11_ETH1 RMII (U40.28)
1L1/UART2_RX_M1/RS232/3V3: P03_SOM CONNECTOR (CON0.126), P08_RS485_RS232_CAN (U29.12)
1M1/UART2_TX_M1/RS232/3V3: P03_SOM CONNECTOR (CON0.125), P08_RS485_RS232_CAN (U29.11)
1M2/PCIE20_PERSTN_M1/3V3: P03_SOM CONNECTOR (CON0.136), P15_4G_5G_NVME (R302.1)
1P12/RESETn/3V3: P05_BOOT SET_KEY_LED_SPI_ADC (R440.1 U66.4), P09_USB HOST_USB OTG (R135.2 R149.2), P10_ETH0 RGMII (U39.2)
1P12/RESETn/PU/3V3: P03_SOM CONNECTOR (CON0.118), P05_BOOT SET_KEY_LED_SPI_ADC (R46.1 U66.2), P06_DEBUG UART_RTC_WD (D9.1 J4.2)
1P14/USB30_OTG0_VBUSDET/3V3: P03_SOM CONNECTOR (CON0.69), P09_USB HOST_USB OTG (C141.1 R164.1 R166.2)
1P15/USB30_OTG0_ID/1V8: P03_SOM CONNECTOR (CON0.70), P09_USB HOST_USB OTG (D10.2 R167.2 U35.9)
AA1/RGMII_TXD0_M0/3V3: P03_SOM CONNECTOR (CON0.6), P10_ETH0 RGMII (U36.19)
AA2/RGMII_TXD1_M0/3V3: P03_SOM CONNECTOR (CON0.5), P10_ETH0 RGMII (U36.18)
AA3/RGMII_TXEN_M0/3V3: P03_SOM CONNECTOR (CON0.2), P10_ETH0 RGMII (U36.20)
AA25/RMII_TXEN/3V3: P03_SOM CONNECTOR (CON0.102), P11_ETH1 RMII (U40.20)
AB2/RGMII_TXD3_M0/3V3: P03_SOM CONNECTOR (CON0.3), P10_ETH0 RGMII (U36.16)
AB3/RGMII_TXD2_M0/3V3: P03_SOM CONNECTOR (CON0.4), P10_ETH0 RGMII (U36.17)
AB26/PCIE20_RXDP: P03_SOM CONNECTOR (CON0.66), P15_4G_5G_NVME (R298.1)
AB27/PCIE20_RXDN: P03_SOM CONNECTOR (CON0.67), P15_4G_5G_NVME (R297.1)
AC1/RGMII_MDC_M0/3V3: P03_SOM CONNECTOR (R420.2), P10_ETH0 RGMII (U36.14)
AC2/RGMII_MDIO_M0/3V3: P03_SOM CONNECTOR (R454.2), P10_ETH0 RGMII (R179.2 U36.15)
AC26/PCIE20_REFCLKP: P03_SOM CONNECTOR (R8.2), P15_4G_5G_NVME (R306.2)
AC27/PCIE20_REFCLKN: P03_SOM CONNECTOR (R9.2), P15_4G_5G_NVME (R304.2)
AD26/PCIE20_TXDP: P03_SOM CONNECTOR (CON0.60), P15_4G_5G_NVME (C255.2)
AD27/PCIE20_TXDN: P03_SOM CONNECTOR (CON0.61), P15_4G_5G_NVME (C254.2)
AE15/GPIO0_B6_d/POWER_EN/3V3: P03_SOM CONNECTOR (CON0.93), P04_POWER (CON4.1 D24.1 R446.2)
AE16/SPI0_CLK_M0/3V3: P03_SOM CONNECTOR (CON0.75), P05_BOOT SET_KEY_LED_SPI_ADC (J2.5 R60.2)
AE18/SPI0_MISO_M0/3V3: P03_SOM CONNECTOR (CON0.74), P05_BOOT SET_KEY_LED_SPI_ADC (J2.4 R59.2)
AE20/UART0_TX_M0/Debug/3V3: P03_SOM CONNECTOR (CON0.82), P06_DEBUG UART_RTC_WD (U6.4)
AE24/GPIO0_A0_d/KEY/3V3: P03_SOM CONNECTOR (CON0.96), P05_BOOT SET_KEY_LED_SPI_ADC (R61.1)
AE26/USB20_HOST1_DM: P03_SOM CONNECTOR (CON0.55), P09_USB HOST_USB OTG (U30.1)
AE27/USB20_HOST1_DP: P03_SOM CONNECTOR (CON0.54), P09_USB HOST_USB OTG (U30.2)
AF15/PWM4_M0/FAN_EN/3V3: P03_SOM CONNECTOR (CON0.94), P07_MICRO SD_FAN_ARM JTAG (R97.1)
AF16/GPIO0_B5_d/POWER_OFF/3V3: P03_SOM CONNECTOR (CON0.92), P04_POWER (CON4.2 D23.1)
AF20/UART0_RX_M0/Debug/3V3: P03_SOM CONNECTOR (CON0.81), P06_DEBUG UART_RTC_WD (U6.5)
AF21/GPIO0_B0_d/EXIO_INTn/3V3: P03_SOM CONNECTOR (CON0.132), P20_WIFI&BT_SDIO_IO EXPANDERS (R408.2 U61.1)
AF26/USB30_OTG0_DM: P03_SOM CONNECTOR (CON0.58), P09_USB HOST_USB OTG (CON11.A7 CON11.B7 U34.1)
AF27/USB30_OTG0_DP: P03_SOM CONNECTOR (CON0.57), P09_USB HOST_USB OTG (CON11.A6 CON11.B6 U34.6)
AG17/SPI0_CSN0_M0/3V3: P03_SOM CONNECTOR (CON0.72), P05_BOOT SET_KEY_LED_SPI_ADC (J2.2 R56.2)
AG19/SPI0_MOSI_M0/3V3: P03_SOM CONNECTOR (CON0.73), P05_BOOT SET_KEY_LED_SPI_ADC (J2.3 R58.2)
D26/SARADC0_BOOT/Maskrom: P03_SOM CONNECTOR (CON0.121), P05_BOOT SET_KEY_LED_SPI_ADC (R54.1)
E2/UART3_RTSN_M1/RS485_RD/3V3: P03_SOM CONNECTOR (CON0.131), P08_RS485_RS232_CAN (U15.4 U15.5)
F26/SARADC0_IN1/KEY/RECOVERY: P03_SOM CONNECTOR (CON0.122), P05_BOOT SET_KEY_LED_SPI_ADC (R55.1)
G2/UART3_TX_M1/RS485/3V3: P03_SOM CONNECTOR (CON0.129), P08_RS485_RS232_CAN (U15.6)
H2/UART3_RX_M1/RS485/3V3: P03_SOM CONNECTOR (CON0.130), P08_RS485_RS232_CAN (R99.2 U15.3)
I2C0_SCL: P03_SOM CONNECTOR (CON0.86 R7.1), P06_DEBUG UART_RTC_WD (R73.2 U9.6), P09_USB HOST_USB OTG (U35.8)
I2C0_SDA: P03_SOM CONNECTOR (CON0.85 R6.1), P06_DEBUG UART_RTC_WD (R74.2 U9.5), P09_USB HOST_USB OTG (U35.7)
I2C1_SCL: P03_SOM CONNECTOR (CON0.84 R4.1), P19_HDMI OUT (R403.2 U54.1), P20_WIFI&BT_SDIO_IO EXPANDERS (R412.1)
I2C1_SDA: P03_SOM CONNECTOR (CON0.83 R5.1), P19_HDMI OUT (R402.2 U54.8), P20_WIFI&BT_SDIO_IO EXPANDERS (R411.1)
J1/PDM_CLK0_M0/PCIE20_CLKREQN_M1/3V3: P03_SOM CONNECTOR (CON0.146 R15.1), P15_4G_5G_NVME (R303.1)
L2/PCIE20_WAKEN_M1/3V3: P03_SOM CONNECTOR (CON0.135), P15_4G_5G_NVME (R305.1)
LED_MODE0: P03_SOM CONNECTOR (CON0.103), P11_ETH1 RMII (R236.1 R239.1 U40.10)
M2/SPI2_CSN1_M0/CAN/3V3: P03_SOM CONNECTOR (CON0.154), P08_RS485_RS232_CAN (U26.16)
M3/SPI2_CSN0_M0/CAN/3V3: P03_SOM CONNECTOR (CON0.155), P08_RS485_RS232_CAN (U23.16)
MDIO: P03_SOM CONNECTOR (R455.2), P11_ETH1 RMII (R222.2 U40.23)
N1/GPIO3_C4_d/CAN1_nINT/3V3: P03_SOM CONNECTOR (CON0.143), P08_RS485_RS232_CAN (R123.1)
N3/SPI2_CLK_M0/CAN/3V3: P03_SOM CONNECTOR (R1.2), P08_RS485_RS232_CAN (C104.1 U23.13 U26.13)
N25/SDMMC0_D2/JTAG_CPU_MCU_TCK_M1/ADJ: P03_SOM CONNECTOR (CON0.114), P07_MICRO SD_FAN_ARM JTAG (U11.4)
N26/SDMMC0_D3/JTAG_CPU_MCU_TMS_M1/ADJ: P03_SOM CONNECTOR (CON0.110), P07_MICRO SD_FAN_ARM JTAG (U11.7)
P2/GPIO3_C7_d/CAN2_nINT/3V3: P03_SOM CONNECTOR (CON0.144), P08_RS485_RS232_CAN (R131.1)
P3/UART4_RTSN_M0/RS485_RD/3V3: P03_SOM CONNECTOR (CON0.145), P08_RS485_RS232_CAN (U21.4 U21.5)
R1/UART4_RX_M0/RS485/3V3: P03_SOM CONNECTOR (CON0.140), P08_RS485_RS232_CAN (R111.2 U21.3)
R2/SPI2_MISO_M0/CAN/3V3: P03_SOM CONNECTOR (CON0.156), P08_RS485_RS232_CAN (R122.1 R130.1)
R3/UART4_TX_M0/RS485/3V3: P03_SOM CONNECTOR (CON0.141), P08_RS485_RS232_CAN (U21.6)
RK809_PWRON/PU/3V3: P03_SOM CONNECTOR (CON0.117), P05_BOOT SET_KEY_LED_SPI_ADC (R48.1)
SD_CLK: P03_SOM CONNECTOR (CON0.109), P07_MICRO SD_FAN_ARM JTAG (CON7.5 R80.2 U12.6)
SD_CMD: P03_SOM CONNECTOR (CON0.113), P07_MICRO SD_FAN_ARM JTAG (CON7.3 R81.2 U13.1)
SD_D0: P03_SOM CONNECTOR (CON0.112), P07_MICRO SD_FAN_ARM JTAG (CON7.7 R79.2 U12.4)
SD_D1: P03_SOM CONNECTOR (CON0.111), P07_MICRO SD_FAN_ARM JTAG (CON7.8 R78.2 U12.3)
SD_DET: P03_SOM CONNECTOR (CON0.95), P07_MICRO SD_FAN_ARM JTAG (R77.2 R85.1 U11.1 U12.1)
SDC_CLK: P03_SOM CONNECTOR (R3.2), P20_WIFI&BT_SDIO_IO EXPANDERS (J15.8 U65.4)
SDC_CMD/3V3: P03_SOM CONNECTOR (CON0.176), P20_WIFI&BT_SDIO_IO EXPANDERS (J15.7 U65.3)
SDC_D0/3V3: P03_SOM CONNECTOR (CON0.171), P20_WIFI&BT_SDIO_IO EXPANDERS (J15.3 U64.3)
SDC_D1/3V3: P03_SOM CONNECTOR (CON0.172), P20_WIFI&BT_SDIO_IO EXPANDERS (J15.4 U64.4)
SDC_D2/3V3: P03_SOM CONNECTOR (CON0.173), P20_WIFI&BT_SDIO_IO EXPANDERS (J15.5 U64.6)
SDC_D3/3V3: P03_SOM CONNECTOR (CON0.174), P20_WIFI&BT_SDIO_IO EXPANDERS (J15.6 U64.1)
SDC_WAKE_HOST/3V3: P03_SOM CONNECTOR (CON0.124), P09_USB HOST_USB OTG (R169.2 R172.2), P20_WIFI&BT_SDIO_IO EXPANDERS (J15.9 U65.6)
T2/GPIO4_B1_d/EVM_LED1/3V3: P03_SOM CONNECTOR (CON0.137), P05_BOOT SET_KEY_LED_SPI_ADC (R50.2)
T3/SPI2_MOSI_M0/CAN/3V3: P03_SOM CONNECTOR (R2.2), P08_RS485_RS232_CAN (C105.1 U23.14 U26.14)
U1/GPIO4_B7_d/EVM_LED2/3V3: P03_SOM CONNECTOR (CON0.138), P05_BOOT SET_KEY_LED_SPI_ADC (R52.2)
U2/RGMII_RXCLK_M0/3V3: P03_SOM CONNECTOR (CON0.12), P10_ETH0 RGMII (R191.1)
V2/RGMII_RXDV_M0/3V3: P03_SOM CONNECTOR (CON0.11), P10_ETH0 RGMII (R190.1)
V27/RMII_RXDV_CRS/3V3: P03_SOM CONNECTOR (CON0.105), P11_ETH1 RMII (U40.26)
W1/RGMII_RXD1_M0/3V3: P03_SOM CONNECTOR (CON0.9), P10_ETH0 RGMII (R187.1)
W2/RGMII_RXD2_M0/3V3: P03_SOM CONNECTOR (CON0.8), P10_ETH0 RGMII (R188.1)
W3/RGMII_RXD0_M0/3V3: P03_SOM CONNECTOR (CON0.7), P10_ETH0 RGMII (R185.1)
W26/RMII_CLK/3V3: P03_SOM CONNECTOR (CON0.107), P11_ETH1 RMII (U40.15)
XL9555_P00/WDI/3V3: P06_DEBUG UART_RTC_WD (U10.1), P20_WIFI&BT_SDIO_IO EXPANDERS (U61.4)
XL9555_P01/WD_SET/3V3: P06_DEBUG UART_RTC_WD (R76.2), P20_WIFI&BT_SDIO_IO EXPANDERS (U61.5)
XL9555_P02/4G_nRST/5G_RSTn/3V3: P15_4G_5G_NVME (Q13.1 R312.1), P20_WIFI&BT_SDIO_IO EXPANDERS (U61.6)
XL9555_P03/USB-DRVVBUS/3V3: P09_USB HOST_USB OTG (R163.2), P20_WIFI&BT_SDIO_IO EXPANDERS (U61.7)
XL9555_P10/RGMII_RST/3V3: P10_ETH0 RGMII (R193.2 U39.1), P20_WIFI&BT_SDIO_IO EXPANDERS (U61.13)
XL9555_P11/RMII_RST/3V3: P11_ETH1 RMII (R220.1), P20_WIFI&BT_SDIO_IO EXPANDERS (U61.14)
XL9555_P12/CAN_nRST/3V3: P08_RS485_RS232_CAN (R124.1 R132.1), P20_WIFI&BT_SDIO_IO EXPANDERS (U61.15)
XL9555_P14/SDIO_EN/KEYB_PWROFFn/LVDS_DEN/DEVSLP/3V3: P15_4G_5G_NVME (R285.1 R293.2), P20_WIFI&BT_SDIO_IO EXPANDERS (R444.1 U61.17)
XL9555_P16/MIPI_LCD_RST/HDMI_nRST/3V3: P19_HDMI OUT (R439.2), P20_WIFI&BT_SDIO_IO EXPANDERS (U61.19)
XL9555_P17/HDMI_EN/3V3: P19_HDMI OUT (D22.1), P20_WIFI&BT_SDIO_IO EXPANDERS (U61.20)
Y2/RGMII_TXCLK_M0/3V3: P03_SOM CONNECTOR (CON0.1), P10_ETH0 RGMII (U36.21)
Y3/RGMII_RXD3_M0/3V3: P03_SOM CONNECTOR (CON0.10), P10_ETH0 RGMII (R189.1)
Y25/RMII_TXD0/3V3: P03_SOM CONNECTOR (CON0.104), P11_ETH1 RMII (U40.16)
Y26/RMII_TXD1/3V3: P03_SOM CONNECTOR (CON0.106), P11_ETH1 RMII (U40.17)
Y27/RMII_RXD0/3V3: P03_SOM CONNECTOR (CON0.101), P11_ETH1 RMII (U40.9)